# Altium project PV Drive.PrjPcb
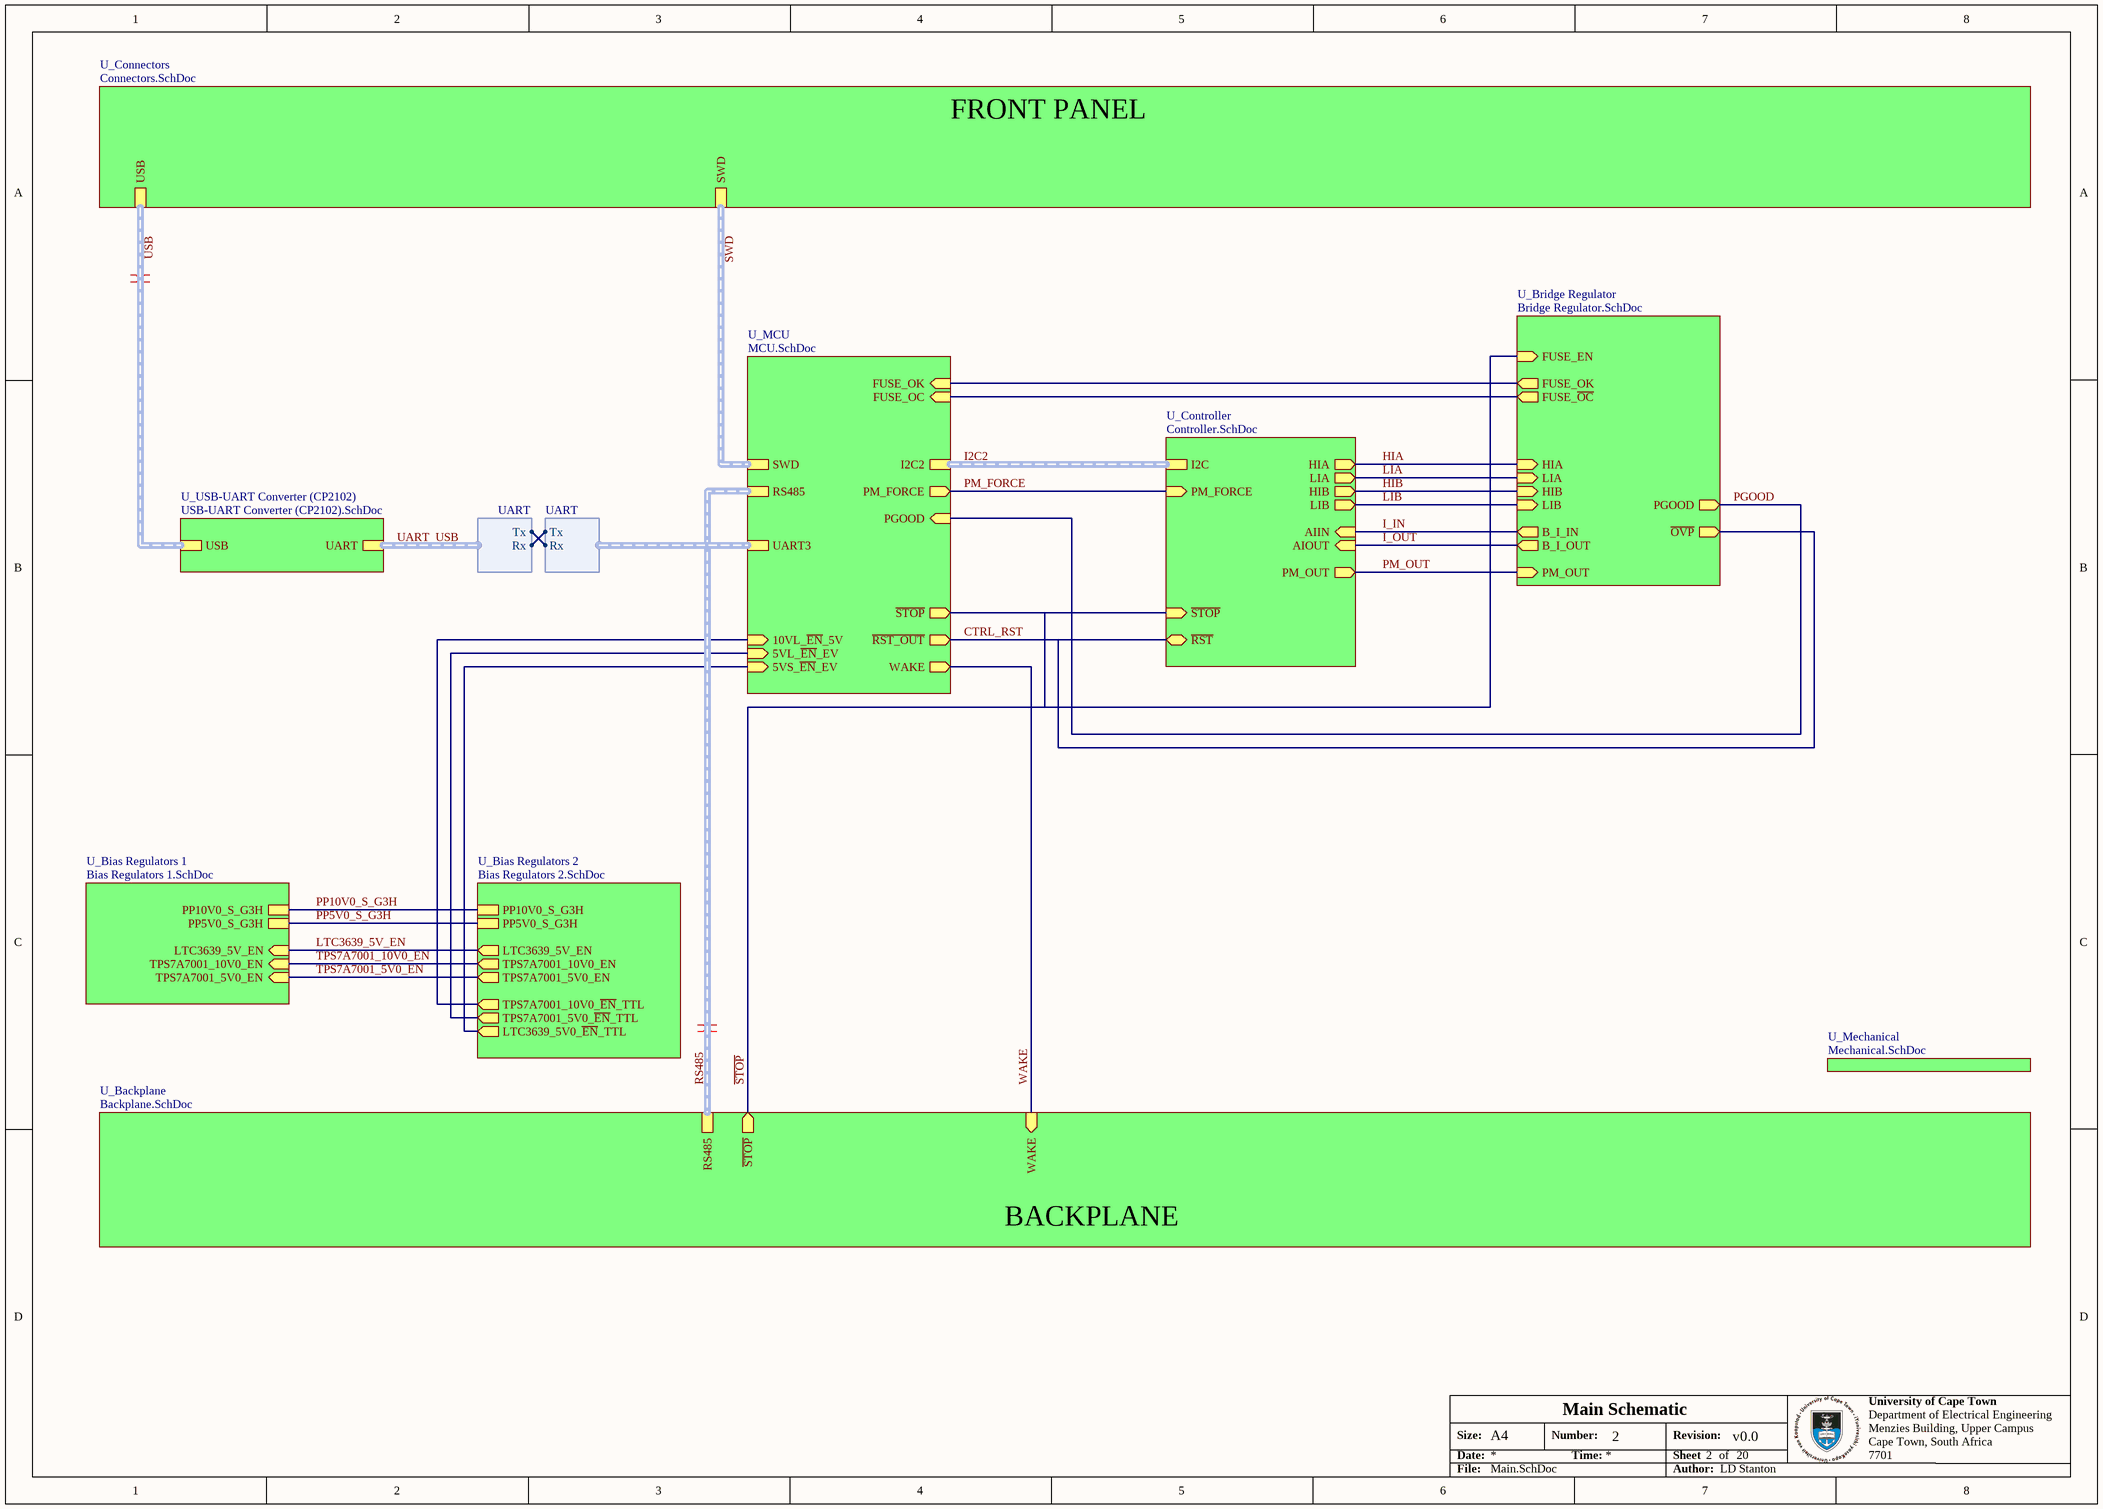
[diagram p0: Main.SchDoc]
Approv_Date_Chk: --/--/----; Approv_Date_Eng: --/--/----; ASM_DOC: Assembley.PCBDwf; BOM_DOC: Bill of Materials.csv; Checker: [UNCHECKED]; CPL_DOC: Pick & Place.csv; DwgTitleLine1: - - - - -; DwgTitleLine2: - - - - -; FAB_DOC: Fabrication.PCBDwf; PCB_DOC: PCB.PcbDoc; Project_Revision: v0.0; Rev_Date_1: --/--/----; Rev_Date_2: --/--/----; Rev_Date_3: --/--/----; Rev_Date_4: --/--/----; Rev_Desc_1: - - - - -; Rev_Desc_2: - - - - -; Rev_Desc_3: - - - - -; Rev_Desc_4: - - - - -; Rev_No_1: -; Rev_No_2: -; Rev_No_3: -; Rev_No_4: -; SCH_DOC: Main.SchDoc
2 sheets, 52 parts. Net scope: hierarchical (ports join the sheet entries above them; power ports are global).
Board file: PCB.PcbDoc
Sheets:
  Main.SchDoc
    U_Controller = Controller.SchDoc

## Sheet Main.SchDoc: Main Schematic
size A3; ApprovedBy: LD Stanton; CheckedBy: None; Author: LD Stanton; DrawnBy: LD Stanton; Engineer: LD Stanton; Organization: University of Cape Town; Address1: Department of Electrical Engineering; Address2: Menzies Building, Upper Campus; Address3: Cape Town, South Africa; Address4: 7701; DocumentNumber: 2; Revision: v1.0; SheetNumber: 2; SheetTotal: 20; Project_Name: Photovoltaic Controller

### Sub-sheets
U_Backplane = Backplane.SchDoc (file not in this document): RS485 (harness RS485), ~{STOP} (out), WAKE (in)
U_Bias Regulators 1 = Bias Regulators 1.SchDoc (file not in this document): PP10V0_S_G3H, TPS7A7001_5V0_EN (in), LTC3639_5V_EN (in), TPS7A7001_10V0_EN (in), PP5V0_S_G3H
U_Bias Regulators 2 = Bias Regulators 2.SchDoc (file not in this document): PP5V0_S_G3H, PP10V0_S_G3H, LTC3639_5V_EN (out), TPS7A7001_10V0_EN (out), TPS7A7001_5V0_EN (out), TPS7A7001_10V0_~{EN}_TTL (out), LTC3639_5V0_~{EN}_TTL (out), TPS7A7001_5V0_~{EN}_TTL (out)
U_Bridge Regulator = Bridge Regulator.SchDoc (file not in this document): LIA (in), HIA (in), HIB (in), LIB (in), B_I_IN (out), B_I_OUT (out), PGOOD (out), ~{OVP} (out), PM_OUT (in), FUSE_EN (in), FUSE_OK (out), FUSE_~{OC} (out)
U_Connectors = Connectors.SchDoc (file not in this document): USB (harness USB), SWD (harness SWD)
U_Controller = Controller.SchDoc: LIB (out), HIA (out), I2C (harness I2C), PM_OUT (out), AIIN (in), AIOUT (in), ~{RST} (bidir), HIB (out), LIA (out), PM_FORCE (in), ~{STOP} (in)
U_MCU = MCU.SchDoc (file not in this document): SWD (harness SWD), UART3 (harness UART), ~{RST_OUT} (out), PM_FORCE (out), WAKE (out), RS485 (harness RS485), I2C2 (harness I2C), FUSE_OK (in), ~{STOP} (out), FUSE_OC (in), PGOOD (in), 5VS_~{EN}_EV (in), 10VL_~{EN}_5V (in), 5VL_~{EN}_EV (in)
U_Mechanical = Mechanical.SchDoc (file not in this document): no entries
U_USB-UART Converter (CP2102) = USB-UART Converter (CP2102).SchDoc (file not in this document): USB (harness USB), UART (harness UART)

### Harnesses
UART: Rx, Tx

### Nets
~{STOP}: sheet U_MCU/~{STOP}, sheet U_Controller/~{STOP}, sheet U_Bridge Regulator/FUSE_EN, sheet U_Backplane/~{STOP}
CTRL_RST: sheet U_MCU/~{RST_OUT}, sheet U_Controller/~{RST}, sheet U_Bridge Regulator/~{OVP}  [project net ~{CTRL_RST}]
HIA: sheet U_Controller/HIA, sheet U_Bridge Regulator/HIA
HIB: sheet U_Controller/HIB, sheet U_Bridge Regulator/HIB
I_IN: sheet U_Controller/AIIN, sheet U_Bridge Regulator/B_I_IN
I_OUT: sheet U_Controller/AIOUT, sheet U_Bridge Regulator/B_I_OUT
LIA: sheet U_Controller/LIA, sheet U_Bridge Regulator/LIA
LIB: sheet U_Controller/LIB, sheet U_Bridge Regulator/LIB
LTC3639_5V_EN: sheet U_Bias Regulators 1/LTC3639_5V_EN, sheet U_Bias Regulators 2/LTC3639_5V_EN
PGOOD: sheet U_MCU/PGOOD, sheet U_Bridge Regulator/PGOOD
PM_FORCE: sheet U_MCU/PM_FORCE, sheet U_Controller/PM_FORCE
PM_OUT: sheet U_Controller/PM_OUT, sheet U_Bridge Regulator/PM_OUT
PP5V0_S_G3H: sheet U_Bias Regulators 1/PP5V0_S_G3H, sheet U_Bias Regulators 2/PP5V0_S_G3H
PP10V0_S_G3H: sheet U_Bias Regulators 1/PP10V0_S_G3H, sheet U_Bias Regulators 2/PP10V0_S_G3H
TPS7A7001_5V0_EN: sheet U_Bias Regulators 1/TPS7A7001_5V0_EN, sheet U_Bias Regulators 2/TPS7A7001_5V0_EN
TPS7A7001_10V0_EN: sheet U_Bias Regulators 1/TPS7A7001_10V0_EN, sheet U_Bias Regulators 2/TPS7A7001_10V0_EN
UART_USB.Rx: sheet U_USB-UART Converter (CP2102)/UART.Rx, sheet U_MCU/UART3.Tx
UART_USB.Tx: sheet U_USB-UART Converter (CP2102)/UART.Tx, sheet U_MCU/UART3.Rx
WAKE: sheet U_MCU/WAKE, sheet U_Backplane/WAKE
(unnamed): sheet U_MCU/FUSE_OK, sheet U_Bridge Regulator/FUSE_OK
(unnamed): sheet U_MCU/FUSE_OC, sheet U_Bridge Regulator/FUSE_~{OC}
(unnamed): sheet U_MCU/5VS_~{EN}_EV, sheet U_Bias Regulators 2/LTC3639_5V0_~{EN}_TTL
(unnamed): sheet U_MCU/10VL_~{EN}_5V, sheet U_Bias Regulators 2/TPS7A7001_10V0_~{EN}_TTL
(unnamed): sheet U_MCU/5VL_~{EN}_EV, sheet U_Bias Regulators 2/TPS7A7001_5V0_~{EN}_TTL

### Buses and harness runs
harness I2C2 = sheet U_Controller/I2C = sheet U_MCU/I2C2
harness RS485 = sheet U_Backplane/RS485 = sheet U_MCU/RS485
harness SWD = sheet U_Connectors/SWD = sheet U_MCU/SWD
harness UART_USB = sheet U_USB-UART Converter (CP2102)/UART
harness USB = sheet U_Connectors/USB = sheet U_USB-UART Converter (CP2102)/USB

### Layout directives
differential pair: (no net found under the mark)

### Notes on the sheet
- FRONT PANEL
- BACKPLANE
- Size:
- Date:
- A4
- Number:
- Time:
- Revision:
- Sheet
- of
- File:
- Author:

## Sheet Controller.SchDoc: Controller
size A4; Project_Name: - - - - -; ApprovedBy: LD Stanton; CheckedBy: None; Author: LD Stanton; CompanyName: University of Cape Town; DrawnBy: Lawrence Stanton; Engineer: Lawrence Stanton; Organization: University of Cape Town; Address1: Department of Electrical Engineering; Address2: Rondebosch; Address3: Cape Town; Address4: South Africa 7701; DocumentNumber: 5; SheetNumber: 5; SheetTotal: 20; Approv_Date_Eng: --/--/----; Approv_Date_Chk: --/--/----; PCB_Doc: TBD; ASM_Doc: TBD; FAB_Doc: TBD; CML_Doc: TBD; BOM_Doc: TBD
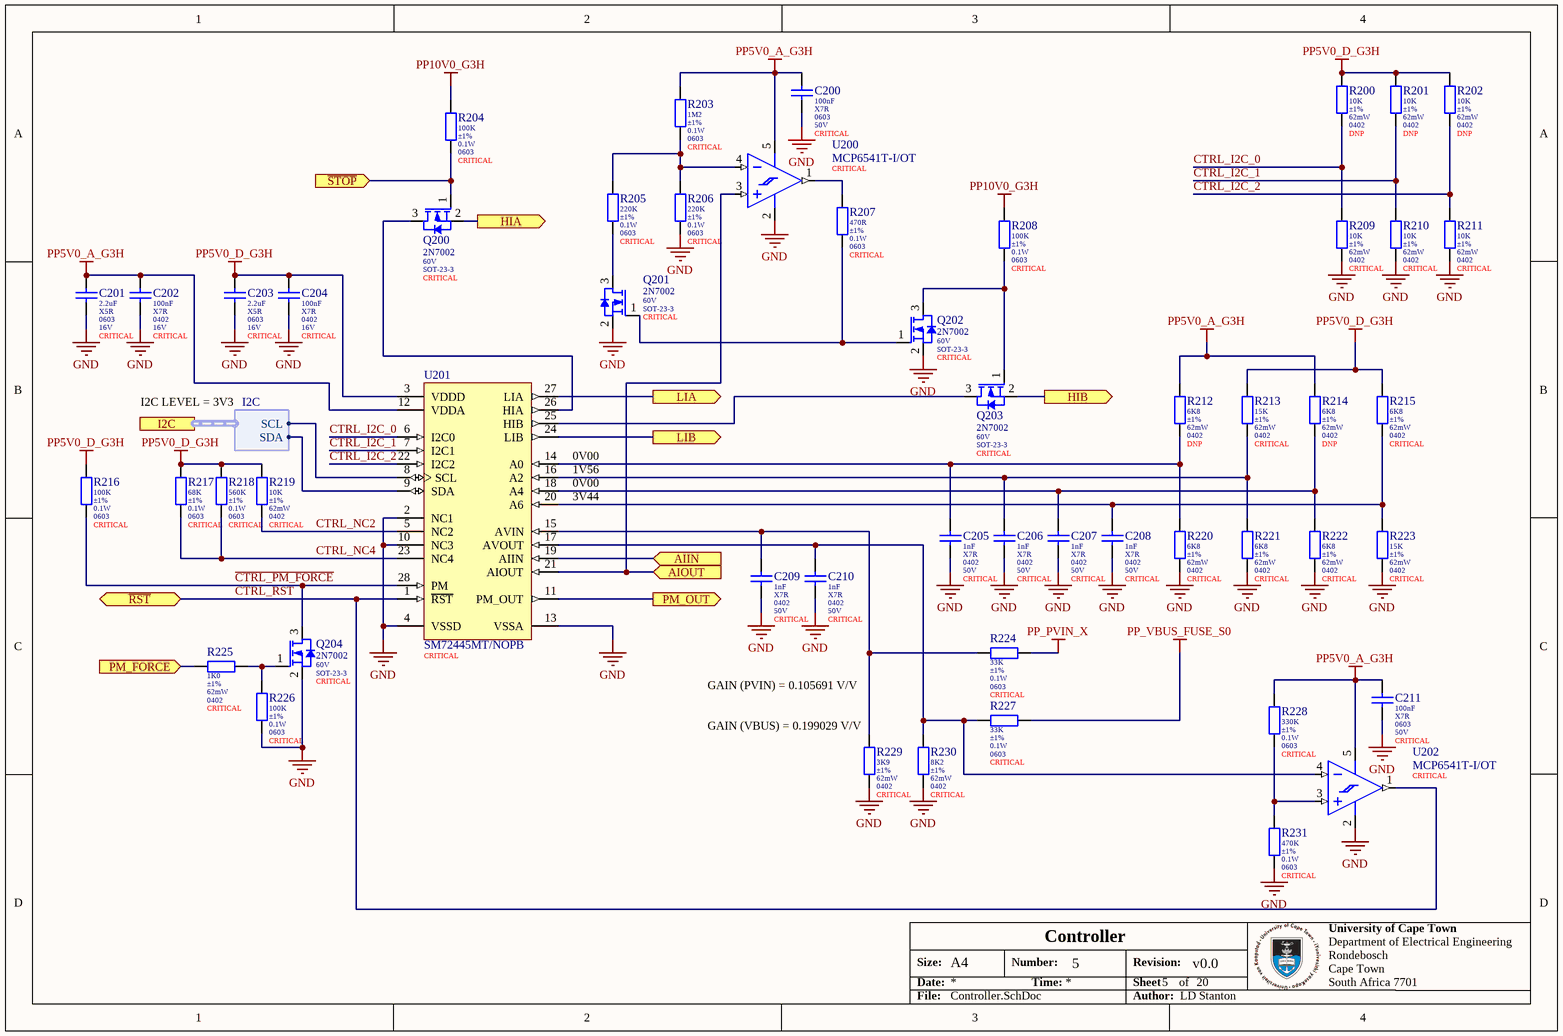
[diagram p1: Controller.SchDoc]

### Parts
C200  value 100nF  Dielectric: X7R  Package: 0603  Voltage: 50V  Populate: CRITICAL  [0603 (Yageo DA) B]  (hidden comment: CC0603KRX7R9BB104)
C201  value 2.2uF  Dielectric: X5R  Package: 0603  Voltage: 16V  Populate: CRITICAL  [0603_080_8 (Samsung) B]  (hidden comment: CL10A225KO8NNNC)
C202  value 100nF  Dielectric: X7R  Package: 0402  Voltage: 16V  Populate: CRITICAL  [0402_050_5 (Samsumg) B]  (hidden comment: CL05B104KO5NNNC)
C203  value 2.2uF  Dielectric: X5R  Package: 0603  Voltage: 16V  Populate: CRITICAL  [0603_080_8 (Samsung) B]  (hidden comment: CL10A225KO8NNNC)
C204  value 100nF  Dielectric: X7R  Package: 0402  Voltage: 16V  Populate: CRITICAL  [0402_050_5 (Samsumg) B]  (hidden comment: CL05B104KO5NNNC)
C205  value 1nF  Dielectric: X7R  Package: 0402  Voltage: 50V  Populate: CRITICAL  [0402_050 (Guandong) B]  (hidden comment: 0402B102K500NT)
C206  value 1nF  Dielectric: X7R  Package: 0402  Voltage: 50V  Populate: CRITICAL  [0402_050 (Guandong) B]  (hidden comment: 0402B102K500NT)
C207  value 1nF  Dielectric: X7R  Package: 0402  Voltage: 50V  Populate: CRITICAL  [0402_050 (Guandong) B]  (hidden comment: 0402B102K500NT)
C208  value 1nF  Dielectric: X7R  Package: 0402  Voltage: 50V  Populate: CRITICAL  [0402_050 (Guandong) B]  (hidden comment: 0402B102K500NT)
C209  value 1nF  Dielectric: X7R  Package: 0402  Voltage: 50V  Populate: CRITICAL  [0402_050 (Guandong) B]  (hidden comment: 0402B102K500NT)
C210  value 1nF  Dielectric: X7R  Package: 0402  Voltage: 50V  Populate: CRITICAL  [0402_050 (Guandong) B]  (hidden comment: 0402B102K500NT)
C211  value 100nF  Dielectric: X7R  Package: 0603  Voltage: 50V  Populate: CRITICAL  [0603 (Yageo DA) B]  (hidden comment: CC0603KRX7R9BB104)
Q200  2N7002  Maximum Drain Source Voltage: 60V  Package: SOT-23-3  Placement: CRITICAL  [SOT-23-3 (2N7002) B]
Q201  2N7002  Maximum Drain Source Voltage: 60V  Package: SOT-23-3  Placement: CRITICAL  [SOT-23-3 (2N7002) B]
Q202  2N7002  Maximum Drain Source Voltage: 60V  Package: SOT-23-3  Placement: CRITICAL  [SOT-23-3 (2N7002) B]
Q203  2N7002  Maximum Drain Source Voltage: 60V  Package: SOT-23-3  Placement: CRITICAL  [SOT-23-3 (2N7002) B]
Q204  2N7002  Maximum Drain Source Voltage: 60V  Package: SOT-23-3  Placement: CRITICAL  [SOT-23-3 (2N7002) B]
R200  value 10K  Tolerance: ±1%  Power: 62mW  Package: 0402  Populate: DNP  [0402 (Uniroyal) B]  (hidden comment: 0402WGF1002TCE)
R201  value 10K  Tolerance: ±1%  Power: 62mW  Package: 0402  Populate: DNP  [0402 (Uniroyal) B]  (hidden comment: 0402WGF1002TCE)
R202  value 10K  Tolerance: ±1%  Power: 62mW  Package: 0402  Populate: DNP  [0402 (Uniroyal) B]  (hidden comment: 0402WGF1002TCE)
R203  value 1M2  Tolerance: ±1%  Power: 0.1W  Package: 0603  Populate: CRITICAL  [0603 (Uniroyal) B]  (hidden comment: 0603WAF1204T5E)
R204  value 100K  Tolerance: ±1%  Power: 0.1W  Package: 0603  Populate: CRITICAL  [0603 (Uniroyal) B]  (hidden comment: 0603WAF1003T5E)
R205  value 220K  Tolerance: ±1%  Power: 0.1W  Package: 0603  Populate: CRITICAL  [0603 (Uniroyal) B]  (hidden comment: 0603WAF2203T5E)
R206  value 220K  Tolerance: ±1%  Power: 0.1W  Package: 0603  Populate: CRITICAL  [0603 (Uniroyal) B]  (hidden comment: 0603WAF2203T5E)
R207  value 470R  Tolerance: ±1%  Power: 0.1W  Package: 0603  Populate: CRITICAL  [0603 (Uniroyal) B]  (hidden comment: 0603WAF4700T5E)
R208  value 100K  Tolerance: ±1%  Power: 0.1W  Package: 0603  Populate: CRITICAL  [0603 (Uniroyal) B]  (hidden comment: 0603WAF1003T5E)
R209  value 10K  Tolerance: ±1%  Power: 62mW  Package: 0402  Populate: CRITICAL  [0402 (Uniroyal) B]  (hidden comment: 0402WGF1002TCE)
R210  value 10K  Tolerance: ±1%  Power: 62mW  Package: 0402  Populate: CRITICAL  [0402 (Uniroyal) B]  (hidden comment: 0402WGF1002TCE)
R211  value 10K  Tolerance: ±1%  Power: 62mW  Package: 0402  Populate: CRITICAL  [0402 (Uniroyal) B]  (hidden comment: 0402WGF1002TCE)
R212  value 6K8  Tolerance: ±1%  Power: 62mW  Package: 0402  Populate: DNP  [0402 (Uniroyal) B]  (hidden comment: 0402WGF6801TCE)
R213  value 15K  Tolerance: ±1%  Power: 62mW  Package: 0402  Populate: CRITICAL  [0402 (Uniroyal) B]  (hidden comment: 0402WGF1502TCE)
R214  value 6K8  Tolerance: ±1%  Power: 62mW  Package: 0402  Populate: DNP  [0402 (Uniroyal) B]  (hidden comment: 0402WGF6801TCE)
R215  value 6K8  Tolerance: ±1%  Power: 62mW  Package: 0402  Populate: CRITICAL  [0402 (Uniroyal) B]  (hidden comment: 0402WGF6801TCE)
R216  value 100K  Tolerance: ±1%  Power: 0.1W  Package: 0603  Populate: CRITICAL  [0603 (Uniroyal) B]  (hidden comment: 0603WAF1003T5E)
R217  value 68K  Tolerance: ±1%  Power: 0.1W  Package: 0603  Populate: CRITICAL  [0603 (Uniroyal) B]  (hidden comment: 0603WAF6802T5E)
R218  value 560K  Tolerance: ±1%  Power: 0.1W  Package: 0603  Populate: CRITICAL  [0603 (Uniroyal) B]  (hidden comment: 0603WAF5603T5E)
R219  value 10K  Tolerance: ±1%  Power: 62mW  Package: 0402  Populate: CRITICAL  [0402 (Uniroyal) B]  (hidden comment: 0402WGF1002TCE)
R220  value 6K8  Tolerance: ±1%  Power: 62mW  Package: 0402  Populate: CRITICAL  [0402 (Uniroyal) B]  (hidden comment: 0402WGF6801TCE)
R221  value 6K8  Tolerance: ±1%  Power: 62mW  Package: 0402  Populate: CRITICAL  [0402 (Uniroyal) B]  (hidden comment: 0402WGF6801TCE)
R222  value 6K8  Tolerance: ±1%  Power: 62mW  Package: 0402  Populate: CRITICAL  [0402 (Uniroyal) B]  (hidden comment: 0402WGF6801TCE)
R223  value 15K  Tolerance: ±1%  Power: 62mW  Package: 0402  Populate: CRITICAL  [0402 (Uniroyal) B]  (hidden comment: 0402WGF1502TCE)
R224  value 33K  Tolerance: ±1%  Power: 0.1W  Package: 0603  Populate: CRITICAL  [0603 (Uniroyal) B]  (hidden comment: 0603WAF3302T5E)
R225  value 1K0  Tolerance: ±1%  Power: 62mW  Package: 0402  Populate: CRITICAL  [0402 (Uniroyal) B]  (hidden comment: 0402WGF1001TCE)
R226  value 100K  Tolerance: ±1%  Power: 0.1W  Package: 0603  Populate: CRITICAL  [0603 (Uniroyal) B]  (hidden comment: 0603WAF1003T5E)
R227  value 33K  Tolerance: ±1%  Power: 0.1W  Package: 0603  Populate: CRITICAL  [0603 (Uniroyal) B]  (hidden comment: 0603WAF3302T5E)
R228  value 330K  Tolerance: ±1%  Power: 0.1W  Package: 0603  Populate: CRITICAL  [0603 (Uniroyal) B]  (hidden comment: 0603WAF3303T5E)
R229  value 3K9  Tolerance: ±1%  Power: 62mW  Package: 0402  Populate: CRITICAL  [0402 (Uniroyal) B]  (hidden comment: 0402WGF3901TCE)
R230  value 8K2  Tolerance: ±1%  Power: 62mW  Package: 0402  Populate: CRITICAL  [0402 (Uniroyal) B]  (hidden comment: 0402WGF8201TCE)
R231  value 470K  Tolerance: ±1%  Power: 0.1W  Package: 0603  Populate: CRITICAL  [0603 (Uniroyal) B]  (hidden comment: 0603WAF4703T5E)
U200  MCP6541T-I/OT  Placement: CRITICAL  [SOT-23-5 (MCP75x) B]
U201  SM72445MT/NOPB  Placement: CRITICAL  [PW0028A_N]
U202  MCP6541T-I/OT  Placement: CRITICAL  [SOT-23-5 (MCP75x) B]

### Ports
AIIN (in), AIOUT (in), HIA (out), HIB (out), I2C (harness I2C), LIA (out), LIB (out), PM_FORCE (in), PM_OUT (out), ~{RST} (bidir), ~{STOP} (in)

### Harnesses
I2C: SCL, SDA

### Nets
GND: C200.2 C201.2 C202.2 C203.2 C204.2 C205.2 C206.2 C207.2 C208.2 C209.2 C210.2 C211.2 Q201.2(S) Q202.2(S) Q204.2(S) R206.2 R209.2 R210.2 R211.2 R220.2 R221.2 R222.2 R223.2 R226.2 R229.2 R230.2 R231.2 U200.2(VSS) U201.2(NC1) U201.4(VSSD) U201.10(NC3) U201.13(VSSA) U202.2(VSS)
PP5V0_A_G3H: C200.1 C201.1 C202.1 C211.1 R203.1 R212.1 R214.1 R228.1 U200.5(VDD) U201.12(VDDA) U202.5(VDD)
PP5V0_D_G3H: C203.1 C204.1 R200.1 R201.1 R202.1 R213.1 R215.1 R216.1 R217.1 R218.1 R219.2 U201.3(VDDD)
PP10V0_G3H: R204.1 R208.1
PP_PVIN_X: R224.2
PP_VBUS_FUSE_S0: R227.2
~{CTRL_PM_FORCE}: Q204.3(D) R216.2 U201.28(PM)
~{CTRL_RST}: U201.1(~{RST}) U202.1(OUT) ; port ~{RST}
~{STOP}: Q200.1(G) R204.2 ; port ~{STOP}
CTRL_I2C_0: R200.2 R209.1 U201.6(I2C0)
CTRL_I2C_1: R201.2 R210.1 U201.7(I2C1)
CTRL_I2C_2: R202.2 R211.1 U201.22(I2C2)
CTRL_NC2: R219.1 U201.5(NC2)
CTRL_NC4: R217.2 R218.2 U201.23(NC4)
HIA: Q200.2(S) ; port HIA
HIB: Q203.2(S) ; port HIB
I2C2.SCL: U201.8(SCL) ; port I2C.SCL
I2C2.SDA: U201.9(SDA) ; port I2C.SDA
I_IN: U201.19(AIIN) ; port AIIN
I_OUT: U200.3(VIN+) U201.21(AIOUT) ; port AIOUT
LIA: U201.27(LIA) ; port LIA
LIB: U201.24(LIB) ; port LIB
PM_FORCE: R225.1 ; port PM_FORCE
PM_OUT: U201.11(PM_OUT) ; port PM_OUT
NetC205_1: C205.1 R212.2 R220.1 U201.14(A0)
NetC206_1: C206.1 R213.2 R221.1 U201.16(A2)
NetC207_1: C207.1 R214.2 R222.1 U201.18(A4)
NetC208_1: C208.1 R215.2 R223.1 U201.20(A6)
NetC209_1: C209.1 R224.1 R229.1 U201.15(AVIN)
NetC210_1: C210.1 R227.1 R230.1 U201.17(AVOUT) U202.4(VIN-)
NetQ200_3: Q200.3(D) U201.26(HIA)
NetQ201_1: Q201.1(G) Q202.1(G) R207.1
NetQ201_3: Q201.3(D) R205.2
NetQ202_3: Q202.3(D) Q203.1(G) R208.2
NetQ203_3: Q203.3(D) U201.25(HIB)
NetQ204_1: Q204.1(G) R225.2 R226.1
NetR203_2: R203.2 R205.1 R206.1 U200.4(VIN-)
NetR207_2: R207.2 U200.1(OUT)
NetR228_2: R228.2 R231.1 U202.3(VIN+)

### Notes on the sheet
- I2C LEVEL = 3V3
- (near U201) 1V56
- (near U201) 0V00
- (near U201) 3V44
- GAIN (PVIN) = 0.105691 V/V
- (near R229) GAIN (VBUS) = 0.199029 V/V
- Size:
- Date:
- A4
- Number:
- Time:
- Revision:
- Sheet
- of
- File:
- Author:

### Library data of the parts
C200 C211 = CMP-047-000000-7: MLCC 100nF 50V 0603 X7R ±10%; Manufacturer: Yageo; LCSC Part Number: C14663; Tolerance: ±10%; ComponentLink1URL: https://datasheet.lcsc.com/szlcsc/YAGEO-CC0603KRX7R9BB104_C14663.pdf; ComponentLink1Description: Datasheet
C201 C203 = CMP-045-000016-8: MLCC 2.2uF 0603 16V X5R ±10%; Manufacturer: Samsung; ComponentLink1URL: https://datasheet.lcsc.com/szlcsc/Samsung-Electro-Mechanics-CL05C100JB5NNNC_C32949.pdf; LCSC Part Number: C23630; Tolerance: ±10%; ComponentLink1Description: Datasheet
C202 C204 = CMP-045-000014-12: MLCC 100nF 0402 16V X7R ±10%; Manufacturer: Samsung; Tolerance: ±10%; ComponentLink1Description: Datasheet; ComponentLink1URL: https://datasheet.lcsc.com/szlcsc/Samsung-Electro-Mechanics-CL05C100JB5NNNC_C32949.pdf; LCSC Part Number: C1525
C205-C210 = CMP-014-000001-9: MLCC 1nF 0402 50V X7R ±10%; Manufacturer: Guandong; LCSC Part Number: C1523; ComponentLink1URL: https://datasheet.lcsc.com/szlcsc/Guangdong-Fenghua-Advanced-Tech-0402B102K500NT_C1523.pdf; ComponentLink1Description: Datasheet; Tolerance: ±10%
Q200-Q204 = CMP-040-000000-14: Small Signal MOSFET, 500 mA, 60 V, N-Channel, Enhancement, JCET SOT-23-3; Gate Threshold Voltage: 2V5; Power: 0.225W; Maximum Drain Current: 0.2A; Maximum Gate Source Voltage: ±20V; Drain-Source On Resistance: 7R; ComponentLink1Description: Datasheet; LCSC Part Number: C8545; ComponentLink1URL: https://datasheet.lcsc.com/szlcsc/Changjiang-Electronics-Tech-CJ-2N7002_C8545.pdf; Manufacturer: JCET
R200-R202 R209-R211 R219 = CMP-010-000292-12: Resistor 10K 0402 ±1% Thick Film Uniroyal; Working Voltage: 50V; Temperature Coefficient: ±100ppm/K; Manufacturer: Uniroyal; Pin Count: 2; ComponentLink1URL: https://datasheet.lcsc.com/szlcsc/1811062009_UNI-ROYAL-Uniroyal-Elec-0603WAF1002T5E_C25804.pdf; LCSC Part Number: C25744; Temperature: -55 - 155°C; ComponentLink1Description: Datasheet
R203 = CMP-010-000374-4: Resistor 1M2 0603 ±1% Thick Film Uniroyal; Temperature Coefficient: ±100ppm/K; Working Voltage: 75V; Temperature: -55 - 155°C; Pin Count: 2; ComponentLink1URL: https://datasheet.lcsc.com/szlcsc/1811062009_UNI-ROYAL-Uniroyal-Elec-0603WAF1002T5E_C25804.pdf; Manufacturer: Uniroyal; LCSC Part Number: C13315; ComponentLink1Description: Datasheet
R204 R208 R216 R226 = CMP-010-000288-10: Resistor 100K 0603 ±1% Thick Film Uniroyal; Working Voltage: 75V; Temperature Coefficient: ±100ppm/K; Manufacturer: Uniroyal; ComponentLink1URL: https://datasheet.lcsc.com/szlcsc/1811062009_UNI-ROYAL-Uniroyal-Elec-0603WAF1002T5E_C25804.pdf; LCSC Part Number: C25803; Temperature: -55 - 155°C; ComponentLink1Description: Datasheet; Pin Count: 2
R205 R206 = CMP-010-000401-2: Resistor 220K 0603 ±1% Thick Film Uniroyal; Temperature Coefficient: ±100ppm/K; Working Voltage: 75V; ComponentLink1URL: https://datasheet.lcsc.com/szlcsc/1811062009_UNI-ROYAL-Uniroyal-Elec-0603WAF1002T5E_C25804.pdf; Manufacturer: Uniroyal; LCSC Part Number: C22961; Temperature: -55 - 155°C; Pin Count: 2; ComponentLink1Description: Datasheet
R207 = CMP-010-000381-2: Resistor 470R 0603 ±5% Thick Film Uniroyal; Working Voltage: 75V; Temperature Coefficient: ±100ppm/K; ComponentLink1Description: Datasheet; Manufacturer: Uniroyal; Temperature: -55 - 155°C; LCSC Part Number: C23179; ComponentLink1URL: https://datasheet.lcsc.com/szlcsc/1811062009_UNI-ROYAL-Uniroyal-Elec-0603WAF1002T5E_C25804.pdf; Pin Count: 2
R212 R214 R215 R220-R222 = CMP-010-000385-1: Resistor 6K8 0402 ±1% Thick Film Uniroyal; Temperature Coefficient: ±100ppm/K; Working Voltage: 50V; Manufacturer: Uniroyal; LCSC Part Number: C25917; ComponentLink1Description: Datasheet; Temperature: -55 - 155°C; ComponentLink1URL: https://datasheet.lcsc.com/szlcsc/1811062009_UNI-ROYAL-Uniroyal-Elec-0603WAF1002T5E_C25804.pdf; Pin Count: 2
R213 R223 = CMP-010-000399-1: Resistor 15K 0402 ±1% Thick Film Uniroyal; Working Voltage: 50V; Temperature Coefficient: ±100ppm/K; ComponentLink1Description: Datasheet; Manufacturer: Uniroyal; Temperature: -55 - 155°C; LCSC Part Number: C25756; ComponentLink1URL: https://datasheet.lcsc.com/szlcsc/1811062009_UNI-ROYAL-Uniroyal-Elec-0603WAF1002T5E_C25804.pdf; Pin Count: 2
R217 = CMP-010-000350-9: Resistor 68K 0603 ±1% Thick Film Uniroyal; Working Voltage: 75V; Temperature Coefficient: ±100ppm/K; ComponentLink1Description: Datasheet; LCSC Part Number: C23231; ComponentLink1URL: https://datasheet.lcsc.com/szlcsc/1811062009_UNI-ROYAL-Uniroyal-Elec-0603WAF1002T5E_C25804.pdf; Temperature: -55 - 155°C; Pin Count: 2; Manufacturer: Uniroyal
R218 = CMP-010-000354-6: Resistor 560K 0603 ±1% Thick Film Uniroyal; Working Voltage: 75V; Temperature Coefficient: ±100ppm/K; Temperature: -55 - 155°C; Pin Count: 2; ComponentLink1URL: https://datasheet.lcsc.com/szlcsc/1811062009_UNI-ROYAL-Uniroyal-Elec-0603WAF1002T5E_C25804.pdf; ComponentLink1Description: Datasheet; LCSC Part Number: C23203; Manufacturer: Uniroyal
R224 R227 = CMP-010-000332-10: Resistor 33K 0603 ±1% Thick Film Uniroyal; Working Voltage: 75V; Temperature Coefficient: ±100ppm/K; Temperature: -55 - 155°C; ComponentLink1URL: https://datasheet.lcsc.com/szlcsc/1811062009_UNI-ROYAL-Uniroyal-Elec-0603WAF1002T5E_C25804.pdf; Manufacturer: Uniroyal; LCSC Part Number: C4216; ComponentLink1Description: Datasheet; Pin Count: 2
R225 = CMP-010-000307-13: Resistor 1K0 0402 ±1% Thick Film Uniroyal; Working Voltage: 50V; Temperature Coefficient: ±100ppm/K; Temperature: -55 - 155°C; ComponentLink1URL: https://datasheet.lcsc.com/szlcsc/1811062009_UNI-ROYAL-Uniroyal-Elec-0603WAF1002T5E_C25804.pdf; Manufacturer: Uniroyal; Pin Count: 2; ComponentLink1Description: Datasheet; LCSC Part Number: C11702
R228 = CMP-010-000382-2: Resistor 330K 0603 ±1% Thick Film Uniroyal; Temperature Coefficient: ±100ppm/K; Working Voltage: 75V; Pin Count: 2; Manufacturer: Uniroyal; ComponentLink1URL: https://datasheet.lcsc.com/szlcsc/1811062009_UNI-ROYAL-Uniroyal-Elec-0603WAF1002T5E_C25804.pdf; LCSC Part Number: C23137; Temperature: -55 - 155°C; ComponentLink1Description: Datasheet
R229 = CMP-010-000334-13: Resistor 3K9 0402 ±1% Thick Film Uniroyal; Working Voltage: 50V; Temperature Coefficient: ±100ppm/K; Manufacturer: Uniroyal; LCSC Part Number: C51721; Temperature: -55 - 155°C; ComponentLink1URL: https://datasheet.lcsc.com/szlcsc/1811062009_UNI-ROYAL-Uniroyal-Elec-0603WAF1002T5E_C25804.pdf; ComponentLink1Description: Datasheet; Pin Count: 2
R230 = CMP-010-000386-1: Resistor 8K2 0402 ±1% Thick Film Uniroyal; Working Voltage: 50V; Temperature Coefficient: ±100ppm/K; ComponentLink1Description: Datasheet; ComponentLink1URL: https://datasheet.lcsc.com/szlcsc/1811062009_UNI-ROYAL-Uniroyal-Elec-0603WAF1002T5E_C25804.pdf; LCSC Part Number: C25924; Manufacturer: Uniroyal; Temperature: -55 - 155°C; Pin Count: 2
R231 = CMP-010-000402-2: Resistor 470K 0603 ±1% Thick Film Uniroyal; Temperature Coefficient: ±100ppm/K; Working Voltage: 75V; ComponentLink1URL: https://datasheet.lcsc.com/szlcsc/1811062009_UNI-ROYAL-Uniroyal-Elec-0603WAF1002T5E_C25804.pdf; Pin Count: 2; Temperature: -55 - 155°C; LCSC Part Number: C23178; ComponentLink1Description: Datasheet; Manufacturer: Uniroyal
U200 U202 = CMP-000025-4: Comparator, Push-Pull, 1V6-5V5, 600nA,  SOT-23-5; Min Supply Voltage: 1.6V; Max Supply Voltage: 5.5V; Propagation Delay: 8us; Quiescent Current: 1uA; Nominal Supply Current: 1mA; Input Bias Current: 1pA; Input Offset Voltage (Vos): 7mV; Hysteresis: 6.5mV; Output Current: 2mA; Package: SOT-23-5; ComponentLink1Description: Datasheet; Output Type: Push-Pull; Min Operating Temperature: -40°C; RoHS: Yes; Max Operating Temperature: 85°C; ComponentLink1URL: https://ww1.microchip.com/downloads/en/DeviceDoc/MCP6541%20Output%20SubMicroamp%20Comparators%2020001696K.pdf; LCSC Part Number: C80839
U201 = CMP-019-00000-4: Texas Instruments MPPT Photovoltaic Cell Controller, 220kHz, TSSOP-28; Min Input Voltage: 4.75V; Input Current: 10nA; Max Supply Voltage: 5.25V; Supply Current: 11.5mA; RoHS: Yes; Max Operating Temperature: 105°C; Min Operating Temperature: -40°C; Height: 0.9mm; ComponentLink1URL: https://www.ti.com/lit/ds/symlink/sm72442.pdf?ts=1624215339045&ref_url=https%253A%252F%252Fwww.ti.com%252Fproduct%252FSM72442; ComponentLink1Description: Datasheet; Max Input Voltage: 5.25V; Case/Package: TSSOP; Min Supply Voltage: 4.75V